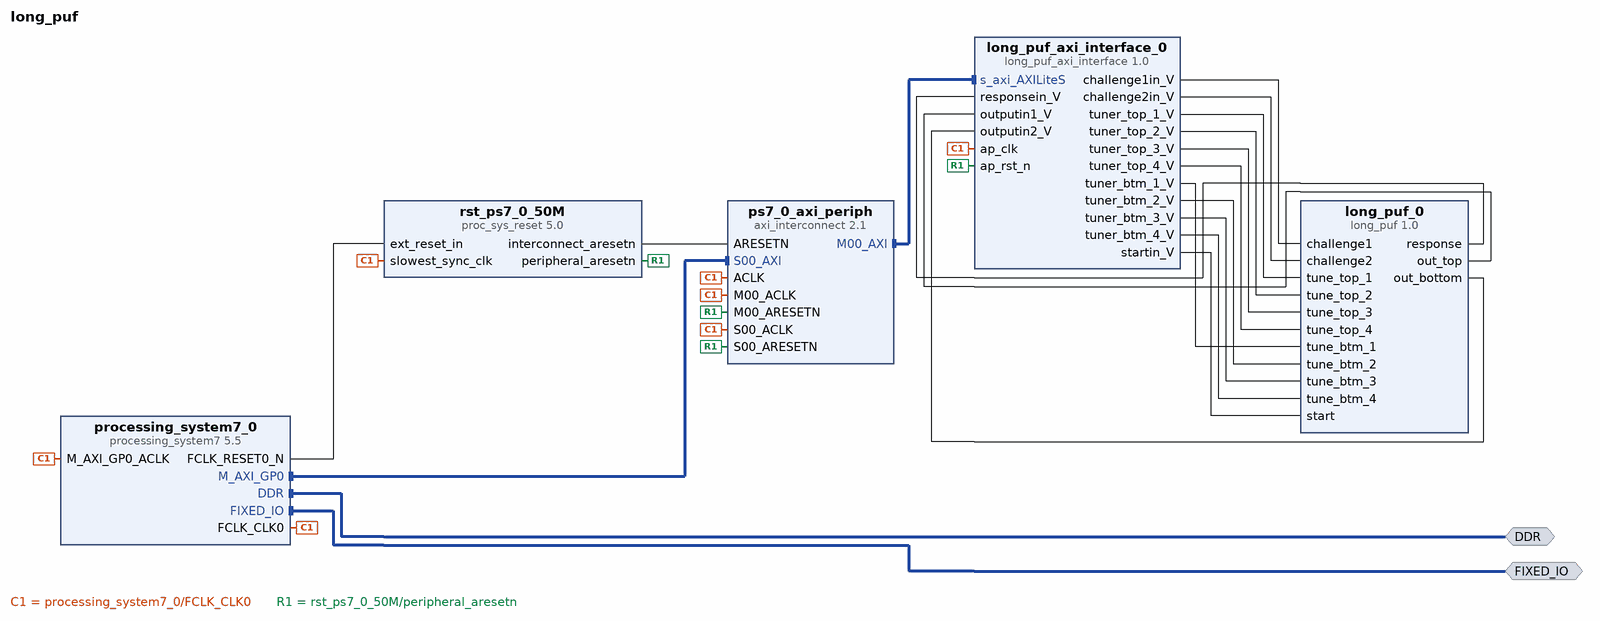
[diagram p0: block diagram of the top level]
# Vivado block design long_puf, xc7z020clg400-1, Vivado 2017.4
create_bd_design long_puf

create_bd_intf_port -mode Master -vlnv xilinx.com:interface:ddrx_rtl:1.0 DDR
create_bd_intf_port -mode Master -vlnv xilinx.com:display_processing_system7:fixedio_rtl:1.0 FIXED_IO

create_bd_cell -type ip -vlnv xilinx.com:ip:processing_system7:5.5 processing_system7_0
# 1 more settings of processing_system7_0 are not shown: defaults, MIO pin electricals, DDR timing, and values the tool derives
create_bd_cell -type ip -vlnv xilinx.com:ip:axi_interconnect:2.1 ps7_0_axi_periph
set_property -dict {CONFIG.NUM_MI 1} [get_bd_cells ps7_0_axi_periph]
create_bd_cell -type ip -vlnv xilinx.com:ip:proc_sys_reset:5.0 rst_ps7_0_50M
create_bd_cell -type ip -vlnv xilinx.com:user:long_puf:1.0 long_puf_0
create_bd_cell -type ip -vlnv xilinx.com:hls:long_puf_axi_interface:1.0 long_puf_axi_interface_0

# ---- connections ----

connect_bd_intf_net [get_bd_intf_pins processing_system7_0/M_AXI_GP0] [get_bd_intf_pins ps7_0_axi_periph/S00_AXI]
connect_bd_intf_net [get_bd_intf_pins ps7_0_axi_periph/M00_AXI] [get_bd_intf_pins long_puf_axi_interface_0/s_axi_AXILiteS]
connect_bd_intf_net [get_bd_intf_ports DDR] [get_bd_intf_pins processing_system7_0/DDR]
connect_bd_intf_net [get_bd_intf_ports FIXED_IO] [get_bd_intf_pins processing_system7_0/FIXED_IO]
connect_bd_net [get_bd_pins processing_system7_0/FCLK_CLK0] \
  [get_bd_pins processing_system7_0/M_AXI_GP0_ACLK] [get_bd_pins ps7_0_axi_periph/S00_ACLK] \
  [get_bd_pins rst_ps7_0_50M/slowest_sync_clk] [get_bd_pins ps7_0_axi_periph/M00_ACLK] [get_bd_pins ps7_0_axi_periph/ACLK] \
  [get_bd_pins long_puf_axi_interface_0/ap_clk]
connect_bd_net [get_bd_pins processing_system7_0/FCLK_RESET0_N] [get_bd_pins rst_ps7_0_50M/ext_reset_in]
connect_bd_net [get_bd_pins rst_ps7_0_50M/peripheral_aresetn] \
  [get_bd_pins ps7_0_axi_periph/S00_ARESETN] [get_bd_pins ps7_0_axi_periph/M00_ARESETN] \
  [get_bd_pins long_puf_axi_interface_0/ap_rst_n]
connect_bd_net [get_bd_pins rst_ps7_0_50M/interconnect_aresetn] [get_bd_pins ps7_0_axi_periph/ARESETN]
connect_bd_net [get_bd_pins long_puf_axi_interface_0/challenge1in_V] [get_bd_pins long_puf_0/challenge1]
connect_bd_net [get_bd_pins long_puf_axi_interface_0/challenge2in_V] [get_bd_pins long_puf_0/challenge2]
connect_bd_net [get_bd_pins long_puf_axi_interface_0/tuner_top_1_V] [get_bd_pins long_puf_0/tune_top_1]
connect_bd_net [get_bd_pins long_puf_axi_interface_0/tuner_top_2_V] [get_bd_pins long_puf_0/tune_top_2]
connect_bd_net [get_bd_pins long_puf_axi_interface_0/tuner_top_3_V] [get_bd_pins long_puf_0/tune_top_3]
connect_bd_net [get_bd_pins long_puf_axi_interface_0/tuner_top_4_V] [get_bd_pins long_puf_0/tune_top_4]
connect_bd_net [get_bd_pins long_puf_axi_interface_0/tuner_btm_1_V] [get_bd_pins long_puf_0/tune_btm_1]
connect_bd_net [get_bd_pins long_puf_axi_interface_0/tuner_btm_2_V] [get_bd_pins long_puf_0/tune_btm_2]
connect_bd_net [get_bd_pins long_puf_axi_interface_0/tuner_btm_3_V] [get_bd_pins long_puf_0/tune_btm_3]
connect_bd_net [get_bd_pins long_puf_axi_interface_0/tuner_btm_4_V] [get_bd_pins long_puf_0/tune_btm_4]
connect_bd_net [get_bd_pins long_puf_axi_interface_0/startin_V] [get_bd_pins long_puf_0/start]
connect_bd_net [get_bd_pins long_puf_0/response] [get_bd_pins long_puf_axi_interface_0/responsein_V]
connect_bd_net [get_bd_pins long_puf_0/out_top] [get_bd_pins long_puf_axi_interface_0/outputin1_V]
connect_bd_net [get_bd_pins long_puf_0/out_bottom] [get_bd_pins long_puf_axi_interface_0/outputin2_V]

# ---- address map ----
assign_bd_address -offset 0x43C00000 -range 64K -target_address_space [get_bd_addr_spaces processing_system7_0/Data] [get_bd_addr_segs long_puf_axi_interface_0/s_axi_AXILiteS/Reg]

validate_bd_design
save_bd_design
